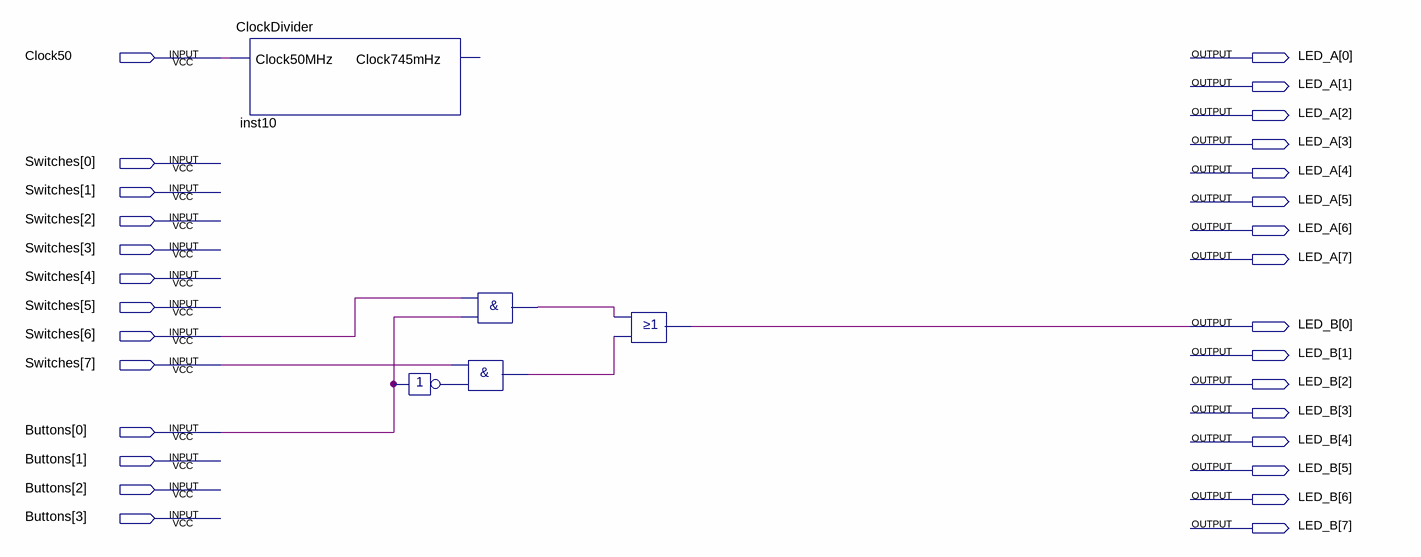
[diagram p0: schematic sheet]
// Quartus schematic 1BitMultiplexer.bdf as structural Verilog: 5 symbols, 29 pins
module \1BitMultiplexer  (
  input  Clock50,
  input  [7:0] Switches,
  input  [3:0] Buttons,
  output [7:0] LED_A,
  output [7:0] LED_B
);

  wire inst2_out, inst3_out, inst4_out;

  ClockDivider inst10 (.Clock50MHz(Clock50));  // open: Clock745mHz
  not inst2 (inst2_out, Buttons[0]);
  and inst4 (inst4_out, Switches[6], Buttons[0]);
  and inst3 (inst3_out, Switches[7], inst2_out);
  or inst1 (LED_B[0], inst4_out, inst3_out);
endmodule
